# Altium schematic sheet giger-counter_Power.SchDoc: Giger-Muller Counter
size 350 x 139 mm; Author: Sumon Ahmed; SheetNumber: 1; SheetTotal: 1
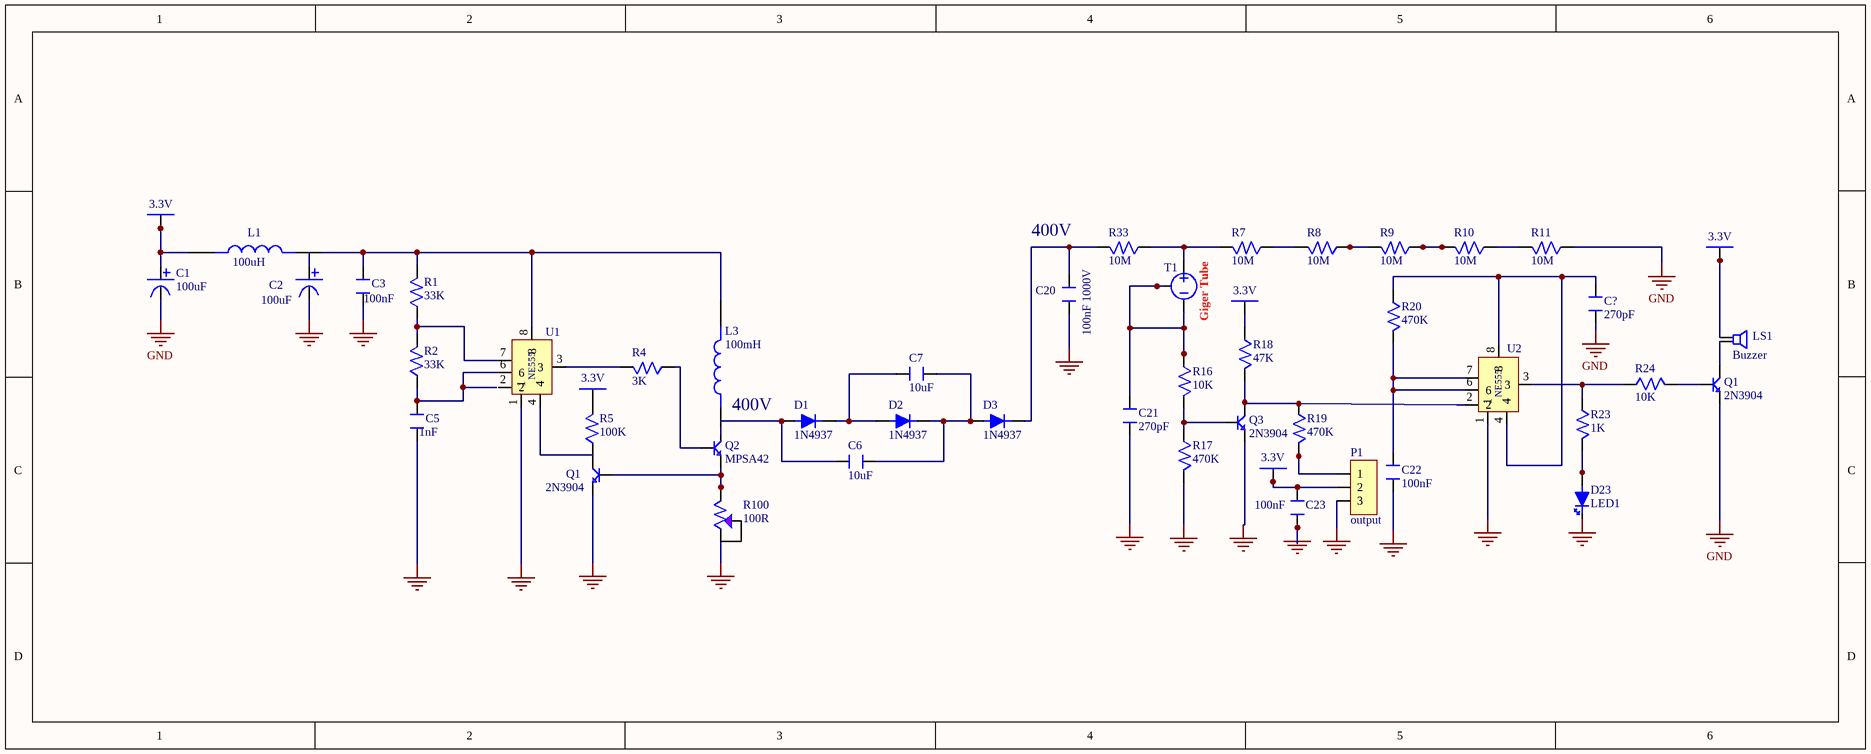
[diagram p0: giger-counter_Power.SchDoc]

## Parts
(Parts that share a designator on the sheet are numbered #1, #2 ... from top to bottom, then left to right.)
?  3.3V  (value not drawn)
C1  100uF
C2  100uF
C3  100nF
C5  1nF
C6  10uF
C7  10uF
C20  100nF 1000V
C21  270pF
C22  100nF
C23  100nF
C?  270pF
D1  1N4937
D2  1N4937
D3  1N4937
D23  LED1
L1  100uH
L3  100mH
LS1  Buzzer
P1  output
Q1#1  2N3904
Q1#2  2N3904
Q2  MPSA42
Q3  2N3904
R1  33K
R2  33K
R4  3K
R5  100K
R7  10M
R8  10M
R9  10M
R10  10M
R11  10M
R16  10K
R17  470K
R18  47K
R19  470K
R20  470K
R23  1K
R24  10K
R33  10M
R100  100R
T1  Giger Tube
U1  555-Timer  (value not drawn)
U2  555-Timer  (value not drawn)
VCC  3.3V  (value not drawn)
VCC2  3.3V  (value not drawn)
VCC3  3.3V  (value not drawn)
VCC?  3.3V  (value not drawn)

## Nets
GND: C1.2 C2.2 C3.1 C5.1 C20.1 C21.1 C22.1 C23.1 C?.1 P1.3 Q1#1.3 Q1#2.2 Q3.3 R11.1 R17.2 R100.1 U1.1 U2.1
Net?_1: ?.1 C23.2 P1.2
NetC1_1: C1.1 L1.1 VCC?.1
NetC3_2: C3.2 L1.2 L3.2 R1.2 U1.8
NetC5_2: C5.2 R2.1 U1.6
NetC6_1: C6.1 D1.2
NetC6_2: C6.2 C7.2 D2.1 D3.2
NetC7_1: C7.1 D1.1 D2.2
NetC20_2: C20.2 D3.1 R33.2
NetC21_2: C21.2 R16.1 T1.2 T1.3
NetC22_2: C22.2 R20.2 U2.6 U2.7
NetC?_2: C?.2 R20.1 U2.4 U2.8
NetD23_2: D23.2 R23.2
NetL3_1: L3.1 Q2.2
NetLS1_1: LS1.1 VCC3.1
NetLS1_2: LS1.2 Q1#1.2
NetP1_1: P1.1 R19.2
NetQ1#1_1: Q1#1.1 R24.2
NetQ1#2_1: Q1#2.1 Q2.3 R100.2
NetQ1#2_3: Q1#2.3 U1.4
NetQ2_1: Q2.1 R4.1
NetQ3_1: Q3.1 R16.2 R17.1
NetQ3_2: Q3.2 R18.2 R19.1 U2.2
NetR1_1: R1.1 R2.2 U1.7
NetR4_2: R4.2 U1.3
NetR7_1: R7.1 R8.2
NetR7_2: R7.2 R33.1 T1.1
NetR8_1: R8.1 R9.2
NetR9_1: R9.1 R10.2
NetR10_1: R10.1 R11.2
NetR18_1: R18.1 VCC2.1
NetR23_1: R23.1 R24.1 U2.3

Not connected (* = marked no-connect by the designer): C2 1; D23 1; R5 1 2; U1 2; VCC 1

## Notes on the sheet
- 400V
- (near L3) 400V
- Labels drawn without touching a wire or pin: GND

## Library data of the parts
? VCC VCC2 VCC3 VCC? = 5V
C1 C2 = Capacitor
C3 C5-C7 C20-C23 C? = Capacitor SMD
D1-D3 = Diode: Manufacturer: Wurth Electronics; Manufacturer Part Number: 150060VS75000; Color: Green; Luminous Intensity: 40mcd; Viewing Angle: 140°; Forward Voltage: 2V; Wavelength: 570nm; Lens Style: Clear,Rectangular; Forward Current: 30mA; Test Current: 20mA; Supplier 1: Digi-Key; RoHS: Yes; Category: LEDs; Stock 1: 278681; Pricing 1: 1=0.15000, 50=0.14200, 100=0.12200, 500=0.10500, 1000=0.09900 (USD); Mount: Surface Mount; Case/Package: 0603; Number of Pins: 2; Case Code (Metric): 1608; Case Code (Imperial): 0603; Min Operating Temperature: -40°C; Max Operating Temperature: 85°C; Package Quantity: 1; Packaging: Tape and Reel; Dominant Wavelength: 570nm; Length: 1.6mm; Width: 0.8mm; Height: 0.7mm; REACH SVHC: Unknown; RoHS Compliant: Yes; ComponentLink1URL: https://datasheet.ciiva.com/29562/150060vs75000-29562919.pdf?src-supplier=Digi-Key; ComponentLink1Description: https://datasheet.ciiva.com/29562/150060vs75000-29562919.pdf?src-supplier=Digi-Key; Supplier Part Number 1: 732-4980-1-ND
D23 = LED: Led, Green, 570 Nm, 2 V, 30 Ma, 40 Mcd Rohs Compliant: Yes; Manufacturer: Wurth Electronics; Manufacturer Part Number: 150060VS75000; Luminous Intensity: 40mcd; Viewing Angle: 140°; Forward Voltage: 2V; Wavelength: 570nm; Lens Style: Clear,Rectangular; Forward Current: 30mA; Test Current: 20mA; Supplier 1: Digi-Key; RoHS: Yes; Category: LEDs; Stock 1: 278681; Pricing 1: 1=0.15000, 50=0.14200, 100=0.12200, 500=0.10500, 1000=0.09900 (USD); Mount: Surface Mount; Case/Package: 0603; Number of Pins: 2; Color: Green; Case Code (Metric): 1608; Case Code (Imperial): 0603; Min Operating Temperature: -40°C; Max Operating Temperature: 85°C; Package Quantity: 1; Packaging: Tape and Reel; Dominant Wavelength: 570nm; Length: 1.6mm; Width: 0.8mm; Height: 0.7mm; REACH SVHC: Unknown; RoHS Compliant: Yes; ComponentLink1URL: https://datasheet.ciiva.com/29562/150060vs75000-29562919.pdf?src-supplier=Digi-Key; ComponentLink1Description: https://datasheet.ciiva.com/29562/150060vs75000-29562919.pdf?src-supplier=Digi-Key; Supplier Part Number 1: 732-4980-1-ND
L1 L3 = Inductor
P1 = Header_3_pin
Q1#1 Q2 Q3 = BJT_NPN
Q1#2 = BJT_PNP
R1 R2 R4 R5 R7-R11 R16-R20 R23 R24 R33 = Resistor
R100 = POT
U1 U2 = NE555PW: Single Precision Timer 8-TSSOP 0 to 70; Manufacturer: Texas Instruments; Frequency: 100kHz; Max Supply Voltage: 16V; Min Supply Voltage: 4.5V; Nominal Supply Current: 2mA; Operating Supply Current: 10mA; Number of Timers/Counters: 1; High Level Output Current: -200mA; Low Level Output Current: 200mA; Quiescent Current: 15mA; Supplier 1: Mouser; Manufacturer Part Number: NE555PW; RoHS: Yes; Category: Timers and Oscillators; Stock 1: 173; Pricing 1: 1=0.88000, 10=0.79200, 25=0.75100, 50=0.75100, 100=0.61700, 300=0.57600, 600=0.50300, 1000=0.50300, 1050=0.45100, 3000=0.38900, 10000=0.38900 (USD); Mount: Surface Mount; Case/Package: TSSOP; Number of Pins: 8; Weight: 0.001376oz; Min Operating Temperature: 0°C; Max Operating Temperature: 70°C; Package Quantity: 150; Packaging: Rail/Tube; Series: NE555; Supply Current: 2mA; Radiation Hardening: No; Lead Free: Lead Free; RoHS Compliant: Yes; ComponentLink1URL: https://datasheet.ciiva.com/1233/ne555-1233456.pdf?src-supplier=Digi-Key; ComponentLink1Description: https://datasheet.ciiva.com/1233/ne555-1233456.pdf?src-supplier=Digi-Key; ComponentLink2URL: https://datasheet.ciiva.com/14273/se555m-14273680.pdf?src-supplier=Avnet; ComponentLink2Description: https://datasheet.ciiva.com/14273/se555m-14273680.pdf?src-supplier=Avnet; ComponentLink3URL: https://datasheet.ciiva.com/15152/getdatasheetpartid-49652-15152550.pdf?src-supplier=Verical; ComponentLink3Description: https://datasheet.ciiva.com/15152/getdatasheetpartid-49652-15152550.pdf?src-supplier=Verical; Supplier Part Number 1: 595-NE555PW